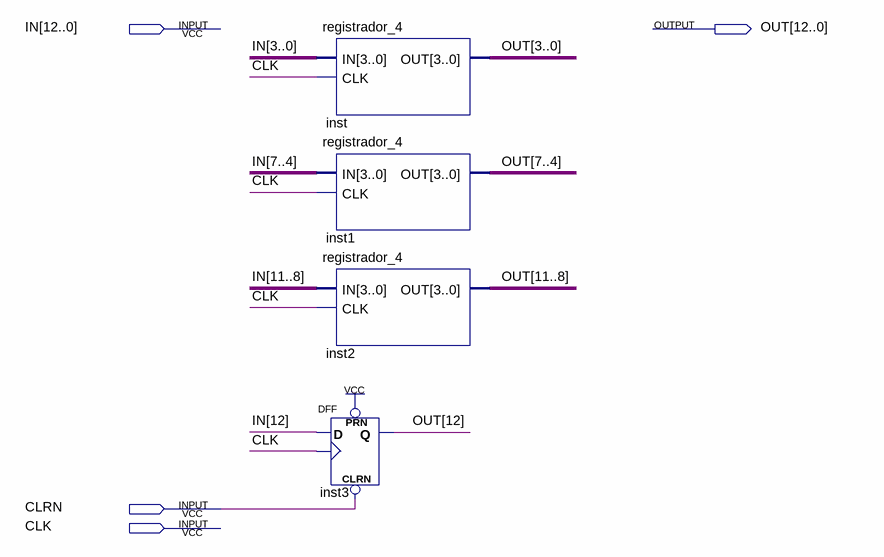
[diagram p0: schematic sheet]
// Quartus schematic registrador_12.bdf as structural Verilog: 4 symbols, 4 pins
module registrador_12 (
  input  [12:0] IN,
  input  CLRN,
  input  CLK,
  output [12:0] OUT
);

  registrador_4 inst (.IN(IN[3:0]), .CLK(CLK), .OUT(OUT[3:0]));
  registrador_4 inst1 (.IN(IN[7:4]), .CLK(CLK), .OUT(OUT[7:4]));
  registrador_4 inst2 (.IN(IN[11:8]), .CLK(CLK), .OUT(OUT[11:8]));
  DFF inst3 (.CLRN(CLRN), .CLK(CLK), .D(IN[12]), .PRN(1'b1), .Q(OUT[12]));
endmodule
